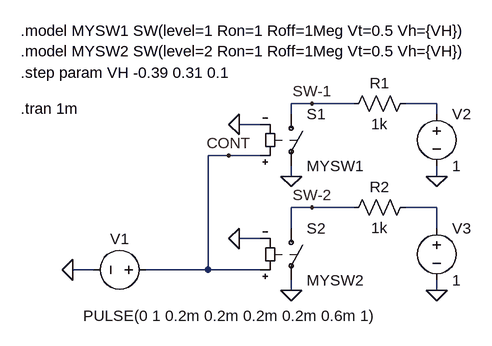
[diagram p0: schematic Fig_2-136_SW-LEVEL_2-3.asc]
Fig_2-136_SW-LEVEL_2-3.asc, the LTspice schematic file:
Version 4
SHEET 1 880 680
WIRE 304 -32 272 -32
WIRE 368 -32 304 -32
WIRE 496 -32 448 -32
WIRE 272 -16 272 -32
WIRE 496 -16 496 -32
WIRE 224 0 192 0
WIRE 176 48 144 48
WIRE 224 48 176 48
WIRE 272 80 272 64
WIRE 496 80 496 64
WIRE 304 128 272 128
WIRE 368 128 304 128
WIRE 496 128 448 128
WIRE 272 160 272 128
WIRE 496 160 496 128
WIRE 224 176 192 176
WIRE -32 224 -64 224
WIRE 144 224 144 48
WIRE 144 224 48 224
WIRE 224 224 144 224
WIRE 272 256 272 240
WIRE 496 256 496 240
FLAG -64 224 0
FLAG 272 256 0
FLAG 496 256 0
FLAG 496 80 0
FLAG 272 80 0
FLAG 192 0 0
FLAG 192 176 0
FLAG 176 48 CONT
FLAG 304 -32 SW-1
FLAG 304 128 SW-2
SYMBOL voltage 64 224 R90
WINDOW 0 -32 56 VBottom 2
WINDOW 3 55 -114 VTop 2
WINDOW 123 0 0 Left 0
WINDOW 39 0 0 Left 0
SYMATTR InstName V1
SYMATTR Value PULSE(0 1 0.2m 0.2m 0.2m 0.2m 0.6m 1)
SYMBOL sw 272 -32 R0
SYMATTR InstName S1
SYMATTR Value MYSW1
SYMBOL sw 272 144 R0
SYMATTR InstName S2
SYMATTR Value MYSW2
SYMBOL voltage 496 -32 R0
SYMATTR InstName V2
SYMATTR Value 1
SYMBOL voltage 496 144 R0
SYMATTR InstName V3
SYMATTR Value 1
SYMBOL res 352 -16 R270
WINDOW 0 32 56 VTop 2
WINDOW 3 0 56 VBottom 2
SYMATTR InstName R1
SYMATTR Value 1k
SYMBOL res 352 144 R270
WINDOW 0 32 56 VTop 2
WINDOW 3 0 56 VBottom 2
SYMATTR InstName R2
SYMATTR Value 1k
TEXT -144 -144 Left 2 !.model MYSW1 SW(level=1 Ron=1 Roff=1Meg Vt=0.5 Vh={VH})\n.model MYSW2 SW(level=2 Ron=1 Roff=1Meg Vt=0.5 Vh={VH})
TEXT -144 -80 Left 2 !.step param VH -0.39 0.31 0.1
TEXT -144 -24 Left 2 !.tran 1m

The netlist it stands for:
* Fig_2-136_SW-LEVEL_2-3.asc
V1 CONT 0 PULSE(0 1 0.2m 0.2m 0.2m 0.2m 0.6m 1)
S1 SW-1 0 CONT 0 MYSW1
S2 SW-2 0 CONT 0 MYSW2
V2 N001 0 1
V3 N002 0 1
R1 SW-1 N001 1k
R2 SW-2 N002 1k
.model MYSW1 SW(level=1 Ron=1 Roff=1Meg Vt=0.5 Vh={VH})
.model MYSW2 SW(level=2 Ron=1 Roff=1Meg Vt=0.5 Vh={VH})
.step param VH -0.39 0.31 0.1
.tran 1m
.backanno
.end